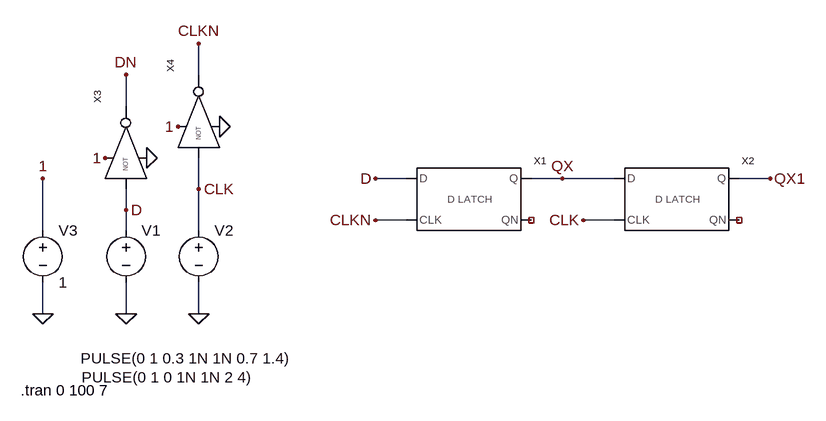
[diagram p0: schematic Draft50.asc]
Draft50.asc, the LTspice schematic file:
Version 4
SHEET 1 880 680
WIRE -240 0 -240 -48
WIRE -352 48 -352 0
WIRE 80 160 32 160
WIRE 320 160 272 160
WIRE 400 160 320 160
WIRE 640 160 592 160
WIRE -240 176 -240 128
WIRE -352 208 -352 176
WIRE 80 224 32 224
WIRE 400 224 352 224
WIRE -480 240 -480 160
WIRE -352 240 -352 208
WIRE -240 240 -240 176
WIRE -480 368 -480 320
WIRE -352 368 -352 320
WIRE -240 368 -240 320
FLAG 32 160 D
FLAG 32 224 CLKN
FLAG 320 160 QX
FLAG 640 160 QX1
FLAG 352 224 CLK
FLAG -384 128 1
FLAG -480 160 1
FLAG -320 128 0
FLAG -480 368 0
FLAG -352 368 0
FLAG -240 368 0
FLAG -352 208 D
FLAG -352 0 DN
FLAG -240 176 CLK
FLAG -272 80 1
FLAG -208 80 0
FLAG -240 -48 CLKN
SYMBOL D_LATCH 160 192 R0
SYMATTR InstName X1
SYMBOL D_LATCH 480 192 R0
SYMATTR InstName X2
SYMBOL voltage -352 224 R0
WINDOW 3 -70 213 Left 2
WINDOW 123 0 0 Left 0
WINDOW 39 0 0 Left 0
SYMATTR InstName V1
SYMATTR Value PULSE(0 1 0.3 1N 1N 0.7 1.4)
SYMBOL voltage -240 224 R0
WINDOW 3 -180 242 Left 2
WINDOW 123 0 0 Left 0
WINDOW 39 0 0 Left 0
SYMATTR InstName V2
SYMATTR Value PULSE(0 1 0 1N 1N 2 4)
SYMBOL NOT4 -336 112 R270
SYMATTR InstName X3
SYMBOL voltage -480 224 R0
WINDOW 123 0 0 Left 0
WINDOW 39 0 0 Left 0
SYMATTR InstName V3
SYMATTR Value 1
SYMBOL NOT4 -224 64 R270
SYMATTR InstName X4
TEXT -514 486 Left 2 !.tran 0 100 7

The netlist it stands for:
* Draft50.asc
XX1 D CLKN QX NC_01 D_LATCH  ; pins D CLK Q QN
XX2 QX CLK QX1 NC_02 D_LATCH  ; pins D CLK Q QN
V1 D 0 PULSE(0 1 0.3 1N 1N 0.7 1.4)
V2 CLK 0 PULSE(0 1 0 1N 1N 2 4)
XX3 D 1 0 DN NOT4  ; pins A VH VL OUT
V3 1 0 1
XX4 CLK 1 0 CLKN NOT4  ; pins A VH VL OUT
.tran 0 100 7
.backanno
.end

* Results of the author's LTspice run, read from the files saved beside the schematic
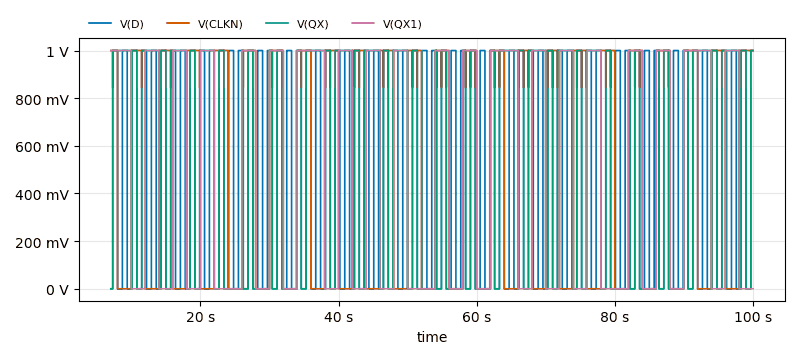
[diagram p1: Transient Analysis of Draft50.asc, plotted from the saved traces]
* Transient Analysis, 1 run:
*   V(D): min -1.657 µV, max 1 V, average 500.1 mV, rms 707.2 mV, last 1 V
*   V(CLKN): min -888.7 nV, max 1.001 V, average 505.2 mV, rms 710.8 mV, last 1 V
*   V(QX): min 0 V, max 1 V, average 558.2 mV, rms 747.1 mV, last 1 V
*   V(QX1): min 0 V, max 1 V, average 505.2 mV, rms 710.8 mV, last 0 V